# EasyEDA schematic open-rally-computer.json
TITLE: Baja Pro v4; REV: 2.0; Date: 2019-03-31; Sheet: 1/1; Drawn By: mattogodoy
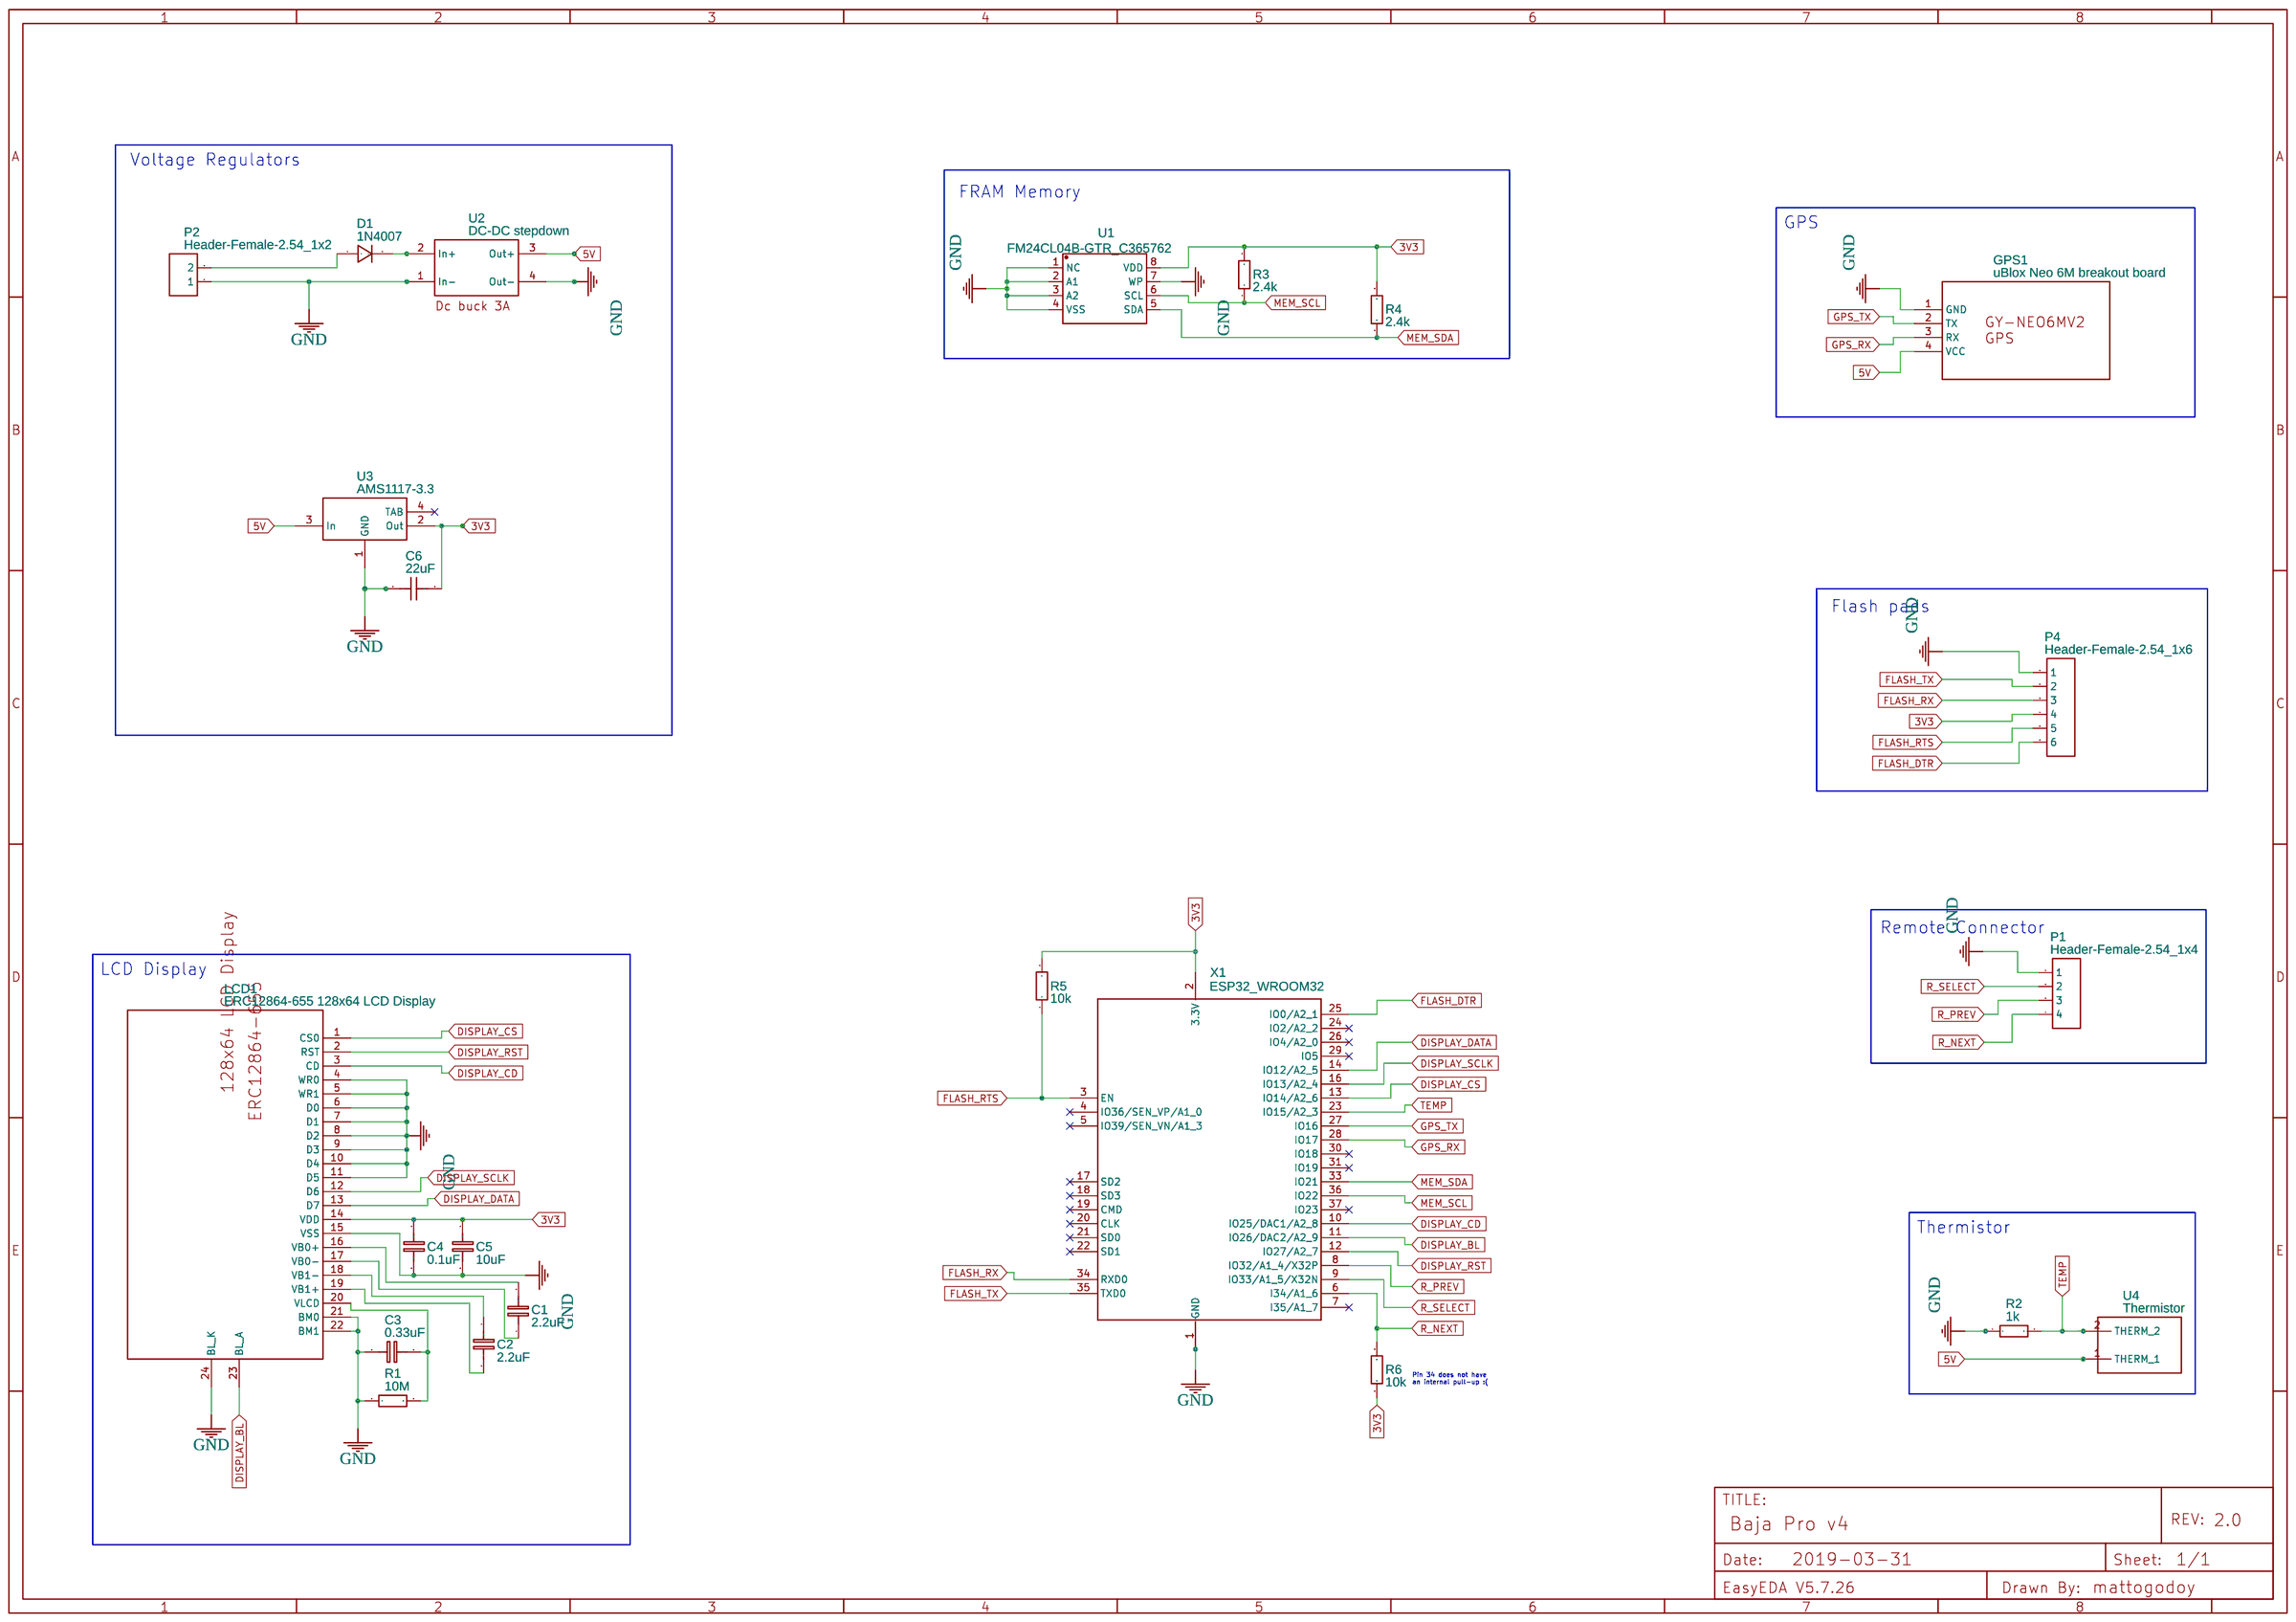
[diagram p0: schematic sheet]

## Parts
C1  2.2uF  [1206]
C2  2.2uF  [1206]
C3  0.33uF  [1206]
C4  0.1uF  [1206]
C5  10uF  [1206]
C6  22uF  [1206]
D1  1N4007  [SOD-123F]
GPS1  uBlox Neo 6M breakout board  [GY-NEO6MV2]
LCD1  ERC12864-655 128x64 LCD Display  [ERC12864-655]
P1  Header-Female-2.54_1x4  [HDR-4X1/2.54]
P2  Header-Female-2.54_1x2  [HDR-1X2/2.54]
P4  Header-Female-2.54_1x6  [HDR-6X1/2.54]
R1  10M  [1206]
R2  1k  [1206]
R3  2.4k  [1206]
R4  2.4k  [1206]
R5  10k  [1206]
R6  10k  [1206]
U1  FM24CL04B-GTR_C365762  [SOIC-8_150MIL]
U2  DC-DC stepdown  [DC-DC STEPDOWN]
U3  AMS1117-3.3  [SOT-223]
U4  Thermistor  [THERMISTOR-PCB]
X1  ESP32_WROOM32  [WROOM32]

## Library data of the parts
C1-C5 = Cap_1206_EU: Manufacturer Part: ?
C6 = 1206B226K160NT: Supplier: LCSC; Manufacturer: FH; Supplier Part: C31847
D1 = -: Supplier Part: C181127; Supplier: LCSC; Manufacturer: Hottech; Contributor: LCSC
GPS1 = -: Contributor: mattogodoy
LCD1 = -: Manufacturer: EastRising Technology Co.; Supplier: BuyDisplay.com; link: https://www.buydisplay.com/download/manual/ERC12864-655_Series_Datasheet.pdf; Contributor: mattogodoy
P1 = -: Supplier: LCSC; Manufacturer: ReliaPro; Supplier Part: C124413
P2 = -: Supplier: LCSC; Manufacturer: BOOMELE; Manufacturer Part: 2.54-1*2PFemale; image: //image.lceda.cn/szlcsc/C49661.jpg; Contributor: LCSC; Supplier Part: C49661
P4 = -: Supplier: LCSC; Manufacturer: BOOMELE; Manufacturer Part: Female header 1*6p; Supplier Part: C40877
R1-R6 = Res_1206(1/4W)_EU: Manufacturer Part: ?
U1 = -: Supplier: LCSC; Supplier Part: C365762; Manufacturer: Cypress Semicon; Manufacturer Part: FM24CL04B-GTR; Contributor: LCSC
U2 = -: Contributor: willumpie; sourceId: mJx7RnvtA; Manufacturer Part: ?
U3 = -: sourceId: dwIGgezVh; Supplier: LCSC; Manufacturer: AMS; LCSC Assembly: Yes; image: //image.lceda.cn/szlcsc/C6186.jpg; Supplier Part: C6186
U4 = -: Contributor: xstaticgrey; Manufacturer Part: ?
X1 = -: Contributor: meggawatts; Manufacturer Part: ?

## Nets
3V3: C4.1 C5.1 C6.2 LCD1.14(VDD) P4.4 R3.2 R4.2 R5.2 R6.1 U1.8(VDD) U3.2(Out) X1.2(3.3V)
5V: GPS1.4(VCC) U2.3(Out+) U3.3(In) U4.1(THERM 1)
GND: C3.1 C4.2 C5.2 C6.1 GPS1.1(GND) LCD1.4(WR0) LCD1.5(WR1) LCD1.6(D0) LCD1.7(D1) LCD1.8(D2) LCD1.9(D3) LCD1.10(D4) LCD1.11(D5) LCD1.15(VSS) LCD1.21(BM0) LCD1.22(BM1) LCD1.24(BL K) P1.1 P2.1 P4.1 R1.1 R2.1 U1.1(NC) U1.2(A1) U1.3(A2) U1.4(VSS) U1.7(WP) U2.1(In-) U2.4(Out-) U3.1(GND) X1.1(GND) X1.15(GND) X1.38(GND) X1.P$1(GND)
DISPLAY_BL: LCD1.23(BL A) X1.11(IO26/DAC2/A2_9)
DISPLAY_CD: LCD1.3(CD) X1.10(IO25/DAC1/A2_8)
DISPLAY_CS: LCD1.1(CS0) X1.13(IO14/A2_6)
DISPLAY_DATA: LCD1.13(D7) X1.14(IO12/A2_5)
DISPLAY_RST: LCD1.2(RST) X1.12(IO27/A2_7)
DISPLAY_SCLK: LCD1.12(D6) X1.16(IO13/A2_4)
FLASH_DTR: P4.6 X1.25(IO0/A2_1)
FLASH_RTS: P4.5 R5.1 X1.3(EN)
FLASH_RX: P4.3 X1.34(RXD0)
FLASH_TX: P4.2 X1.35(TXD0)
GPS_RX: GPS1.3(RX) X1.28(IO17)
GPS_TX: GPS1.2(TX) X1.27(IO16)
MEM_SCL: R3.1 U1.6(SCL) X1.36(IO22)
MEM_SDA: R4.1 U1.5(SDA) X1.33(IO21)
R_NEXT: P1.4 R6.2 X1.6(I34/A1)
R_PREV: P1.3 X1.8(IO32/A1_4/X32P)
R_SELECT: P1.2 X1.9(IO33/A1_5/X32N)
TEMP: R2.2 U4.2(THERM 2) X1.23(IO15/A2_3)
Net-(C1-1): C1.1 LCD1.17(VB0-)
Net-(C1-2): C1.2 LCD1.16(VB0+)
Net-(C2-1): C2.1 LCD1.18(VB1-)
Net-(C2-2): C2.2 LCD1.19(VB1+)
Net-(C3-2): C3.2 LCD1.20(VLCD) R1.2
Net-(D1-1): D1.1(+) P2.2
Net-(D1-2): D1.2(-) U2.2(In+)

Not connected (* = marked no-connect by the designer): U3 4(TAB)*; X1 4(IO36/SEN_VP/A1_0)* 5(IO39/SEN_VN/A1_3)* 7(I35/A1)* 17(SD2)* 18(SD3)* 19(CMD)* 20(CLK)* 21(SD0)* 22(SD1)* 24(IO2/A2_2)* 26(IO4/A2_0)* 29(IO5)* 30(IO18)* 31(IO19)* 37(IO23)*

## Notes on the sheet
- Voltage Regulators
- FRAM Memory
- GPS
- Flash pads
- Remote Connector
- LCD Display
- Thermistor
- Pin 34 does not have
  an internal pull-up :(
